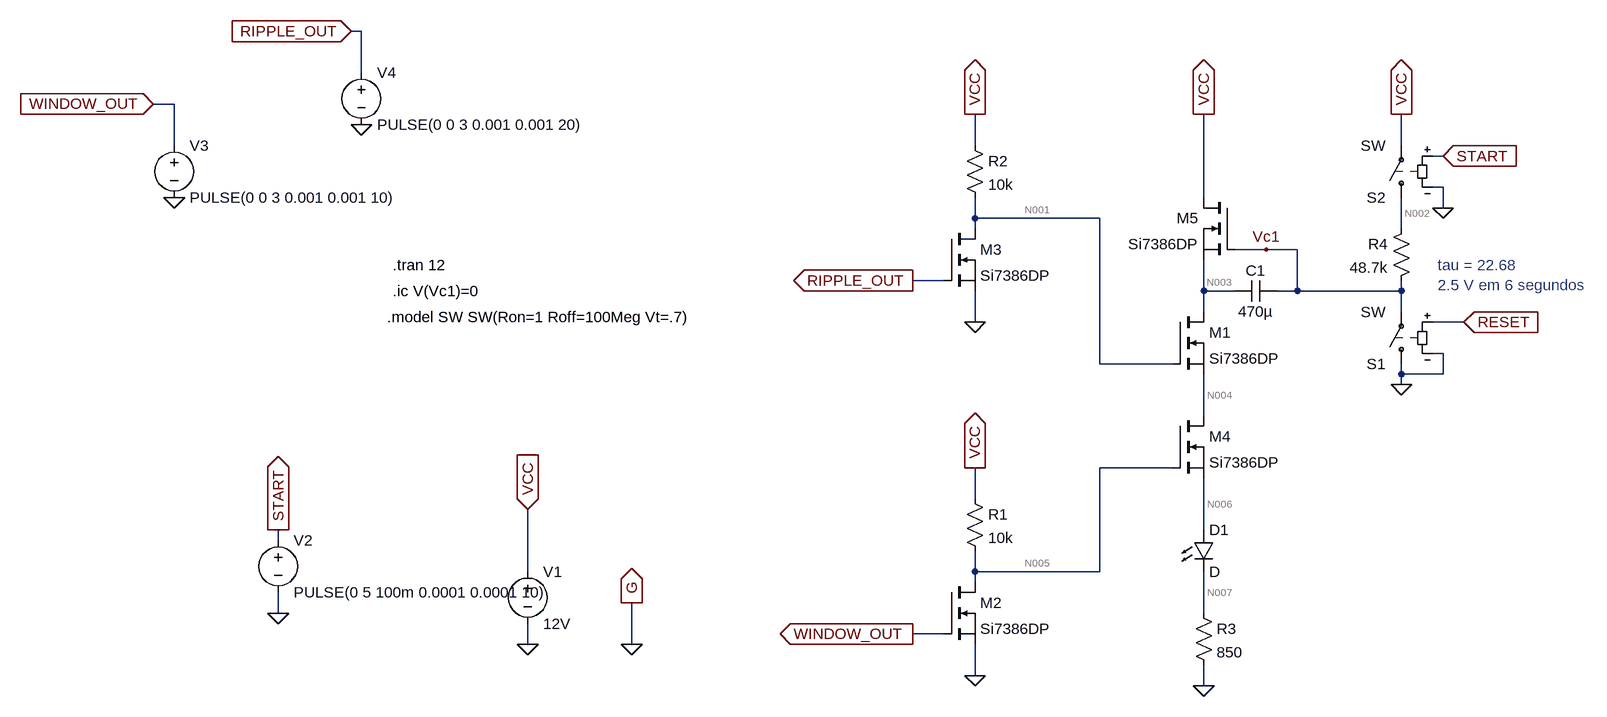
[diagram p0: schematic led_logic.asc]
led_logic.asc, the LTspice schematic file:
Version 4
SHEET 1 880 680
WIRE -1808 -368 -1824 -368
WIRE -1808 -304 -1808 -368
WIRE -2096 -256 -2128 -256
WIRE -2096 -192 -2096 -256
WIRE -864 -192 -864 -240
WIRE -208 -192 -208 -240
WIRE -144 -176 -160 -176
WIRE -144 -128 -160 -128
WIRE -512 -112 -512 -240
WIRE -144 -96 -144 -128
WIRE -864 -80 -864 -112
WIRE -672 -80 -864 -80
WIRE -864 -64 -864 -80
WIRE -208 -64 -208 -112
WIRE -416 -32 -464 -32
WIRE -368 -32 -416 -32
WIRE -912 16 -960 16
WIRE -512 32 -512 -16
WIRE -464 32 -512 32
WIRE -368 32 -368 -32
WIRE -368 32 -400 32
WIRE -208 32 -208 16
WIRE -208 32 -368 32
WIRE -512 64 -512 32
WIRE -208 64 -208 32
WIRE -864 80 -864 32
WIRE -112 80 -160 80
WIRE -144 128 -160 128
WIRE -672 144 -672 -80
WIRE -560 144 -672 144
WIRE -208 160 -208 144
WIRE -144 160 -144 128
WIRE -144 160 -208 160
WIRE -208 176 -208 160
WIRE -512 224 -512 160
WIRE -560 304 -672 304
WIRE -864 352 -864 304
WIRE -512 400 -512 320
WIRE -1936 416 -1936 400
WIRE -1552 464 -1552 368
WIRE -864 464 -864 432
WIRE -672 464 -672 304
WIRE -672 464 -864 464
WIRE -864 480 -864 464
WIRE -1936 528 -1936 496
WIRE -512 528 -512 464
WIRE -912 560 -960 560
WIRE -1552 576 -1552 544
WIRE -1392 576 -1392 512
WIRE -864 624 -864 576
WIRE -512 640 -512 608
FLAG -960 560 WINDOW_OUT
IOPIN -960 560 Out
FLAG -960 16 RIPPLE_OUT
IOPIN -960 16 Out
FLAG -864 304 VCC
IOPIN -864 304 Out
FLAG -864 624 0
FLAG -864 -240 VCC
IOPIN -864 -240 Out
FLAG -864 80 0
FLAG -512 640 0
FLAG -208 176 0
FLAG -416 -32 Vc1
FLAG -512 -240 VCC
IOPIN -512 -240 Out
FLAG -208 -240 VCC
IOPIN -208 -240 Out
FLAG -144 -176 START
IOPIN -144 -176 In
FLAG -144 -96 0
FLAG -112 80 RESET
IOPIN -112 80 In
FLAG -1552 576 0
FLAG -1392 512 G
IOPIN -1392 512 Out
FLAG -1392 576 0
FLAG -1552 368 VCC
IOPIN -1552 368 In
FLAG -1936 528 0
FLAG -1936 400 START
IOPIN -1936 400 Out
FLAG -2096 -112 0
FLAG -1808 -224 0
FLAG -1824 -368 RIPPLE_OUT
IOPIN -1824 -368 In
FLAG -2128 -256 WINDOW_OUT
IOPIN -2128 -256 In
SYMBOL nmos -560 64 R0
SYMATTR InstName M1
SYMATTR Value Si7386DP
SYMBOL nmos -912 480 R0
SYMATTR InstName M2
SYMATTR Value Si7386DP
SYMBOL res -880 336 R0
SYMATTR InstName R1
SYMATTR Value 10k
SYMBOL nmos -912 -64 R0
SYMATTR InstName M3
SYMATTR Value Si7386DP
SYMBOL res -880 -208 R0
SYMATTR InstName R2
SYMATTR Value 10k
SYMBOL nmos -560 224 R0
SYMATTR InstName M4
SYMATTR Value Si7386DP
SYMBOL LED -528 400 R0
SYMATTR InstName D1
SYMBOL res -528 512 R0
SYMATTR InstName R3
SYMATTR Value 850
SYMBOL res -192 -80 M0
SYMATTR InstName R4
SYMATTR Value 48.7k
SYMBOL cap -400 48 M270
WINDOW 0 32 32 VTop 2
WINDOW 3 0 32 VBottom 2
SYMATTR InstName C1
SYMATTR Value 470µ
SYMBOL nmos -464 -112 M0
SYMATTR InstName M5
SYMATTR Value Si7386DP
SYMBOL sw -208 160 R180
SYMATTR InstName S1
SYMBOL sw -208 -96 R180
SYMATTR InstName S2
SYMBOL voltage -1552 448 R0
SYMATTR InstName V1
SYMATTR Value 12V
SYMBOL voltage -1936 400 R0
WINDOW 123 0 0 Left 0
WINDOW 39 0 0 Left 0
SYMATTR InstName V2
SYMATTR Value PULSE(0 5 100m 0.0001 0.0001 10)
SYMBOL voltage -2096 -208 R0
WINDOW 123 0 0 Left 0
WINDOW 39 0 0 Left 0
SYMATTR InstName V3
SYMATTR Value PULSE(0 0 3 0.001 0.001 10)
SYMBOL voltage -1808 -320 R0
WINDOW 123 0 0 Left 0
WINDOW 39 0 0 Left 0
SYMATTR InstName V4
SYMATTR Value PULSE(0 0 3 0.001 0.001 20)
TEXT -152 -8 Left 2 ;tau = 22.68\n2.5 V em 6 segundos
TEXT -1760 -8 Left 2 !.tran 12
TEXT -1768 72 Left 2 !.model SW SW(Ron=1 Roff=100Meg Vt=.7)
TEXT -1760 32 Left 2 !.ic V(Vc1)=0

The netlist it stands for:
* led_logic.asc
M1 N003 N001 N004 N004 Si7386DP
M2 N005 WINDOW_OUT 0 0 Si7386DP
R1 VCC N005 10k
M3 N001 RIPPLE_OUT 0 0 Si7386DP
R2 VCC N001 10k
M4 N004 N005 N006 N006 Si7386DP
D1 N006 N007 D
R3 N007 0 850
R4 N002 Vc1 48.7k
C1 Vc1 N003 470µ
M5 VCC Vc1 N003 N003 Si7386DP
S1 0 Vc1 RESET 0 SW
S2 N002 VCC START 0 SW
V1 VCC 0 12V
V2 START 0 PULSE(0 5 100m 0.0001 0.0001 10)
V3 WINDOW_OUT 0 PULSE(0 0 3 0.001 0.001 10)
V4 RIPPLE_OUT 0 PULSE(0 0 3 0.001 0.001 20)
.model D D
.lib standard.dio
.model NMOS NMOS
.model PMOS PMOS
.lib standard.mos
* tau = 22.68
* 2.5 V em 6 segundos
.tran 12
.model SW SW(Ron=1 Roff=100Meg Vt=.7)
.ic V(Vc1)=0
.backanno
.end

* Results of the author's LTspice run, read from the files saved beside the schematic
* Operating Point, zero values left out:
*   V(n003) = 203.1 mV
*   V(n001) = 12 V
*   V(n004) = 203.1 mV
*   V(n005) = 12 V
*   V(vcc) = 12 V
*   V(n006) = 203.1 mV
*   V(n007) = 22.06 nV
*   V(n002) = 5.842 mV
*   Id(M5) = 13.91 pA
*   Is(M5) = -13.91 pA
*   Id(M4) = 25.67 pA
*   Is(M4) = -25.67 pA
*   Id(M3) = 14.21 pA
*   Is(M3) = -14.21 pA
*   Id(M2) = 14.21 pA
*   Is(M2) = -14.21 pA
*   Id(M1) = 25.67 pA
*   Is(M1) = -25.67 pA
*   I(D1) = 25.95 pA
*   I(R4) = 120 nA
*   I(R3) = 25.95 pA
*   I(R2) = 25.93 pA
*   I(R1) = 26.96 pA
*   I(S2) = 120 nA
*   I(V1) = -120 nA
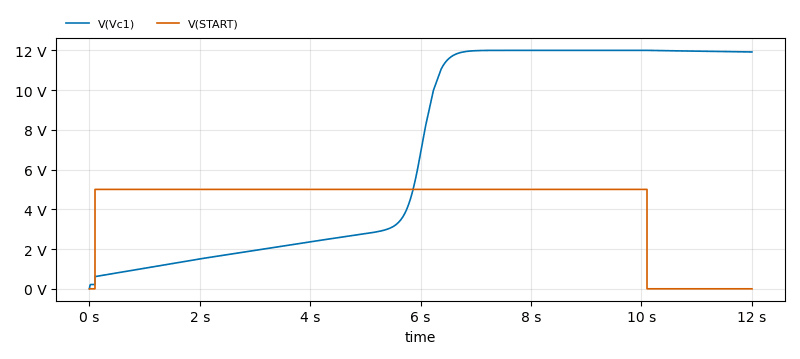
[diagram p1: Transient Analysis of led_logic.asc, plotted from the saved traces]
* Transient Analysis, 1 run:
*   V(Vc1): min 0 V, max 11.99 V, average 6.901 V, rms 8.505 V, last 11.91 V
*   V(START): min 0 V, max 5 V, average 4.167 V, rms 4.564 V, last 0 V